# EAGLE design Pressure_Module_v2.1_jan2024 (EAGLE 9.6.2)

## Sheet 1 of 2: Connectors
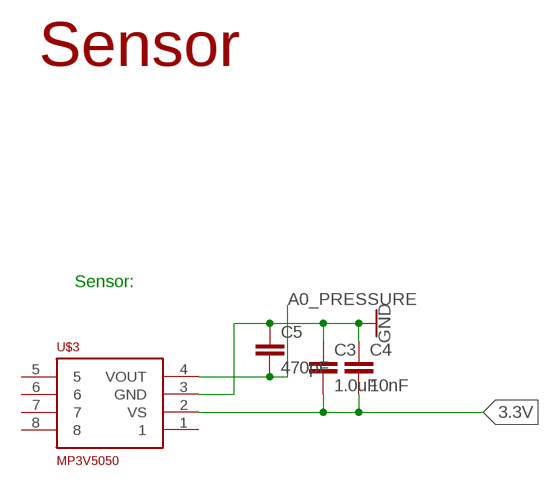
[diagram p0: schematic, sheet 1]

### Parts
C3  1.0uF  1.0UF-0603-16V-10%  [0603]
C4  10nF  10NF-0603-50V-10%  [0603]
C5  470pF  470PF-0603-50V-5%  [0603]
U$3  MP3V5050  [PRESSURE_SENSOR]

### Nets
3.3V: C3.2 C4.2 U$3.2(VS) ; also sheet 2
A0_PRESSURE: C5.2 U$3.4(VOUT) ; also sheet 2
GND: C3.1 C4.1 C5.1 U$3.3(GND) ; also sheet 2
Unconnected: U$3.1 U$3.5 U$3.6 U$3.7 U$3.8

### Notes on the sheet
- Sensor
- Sensor:

## Sheet 2 of 2: Microcontroller
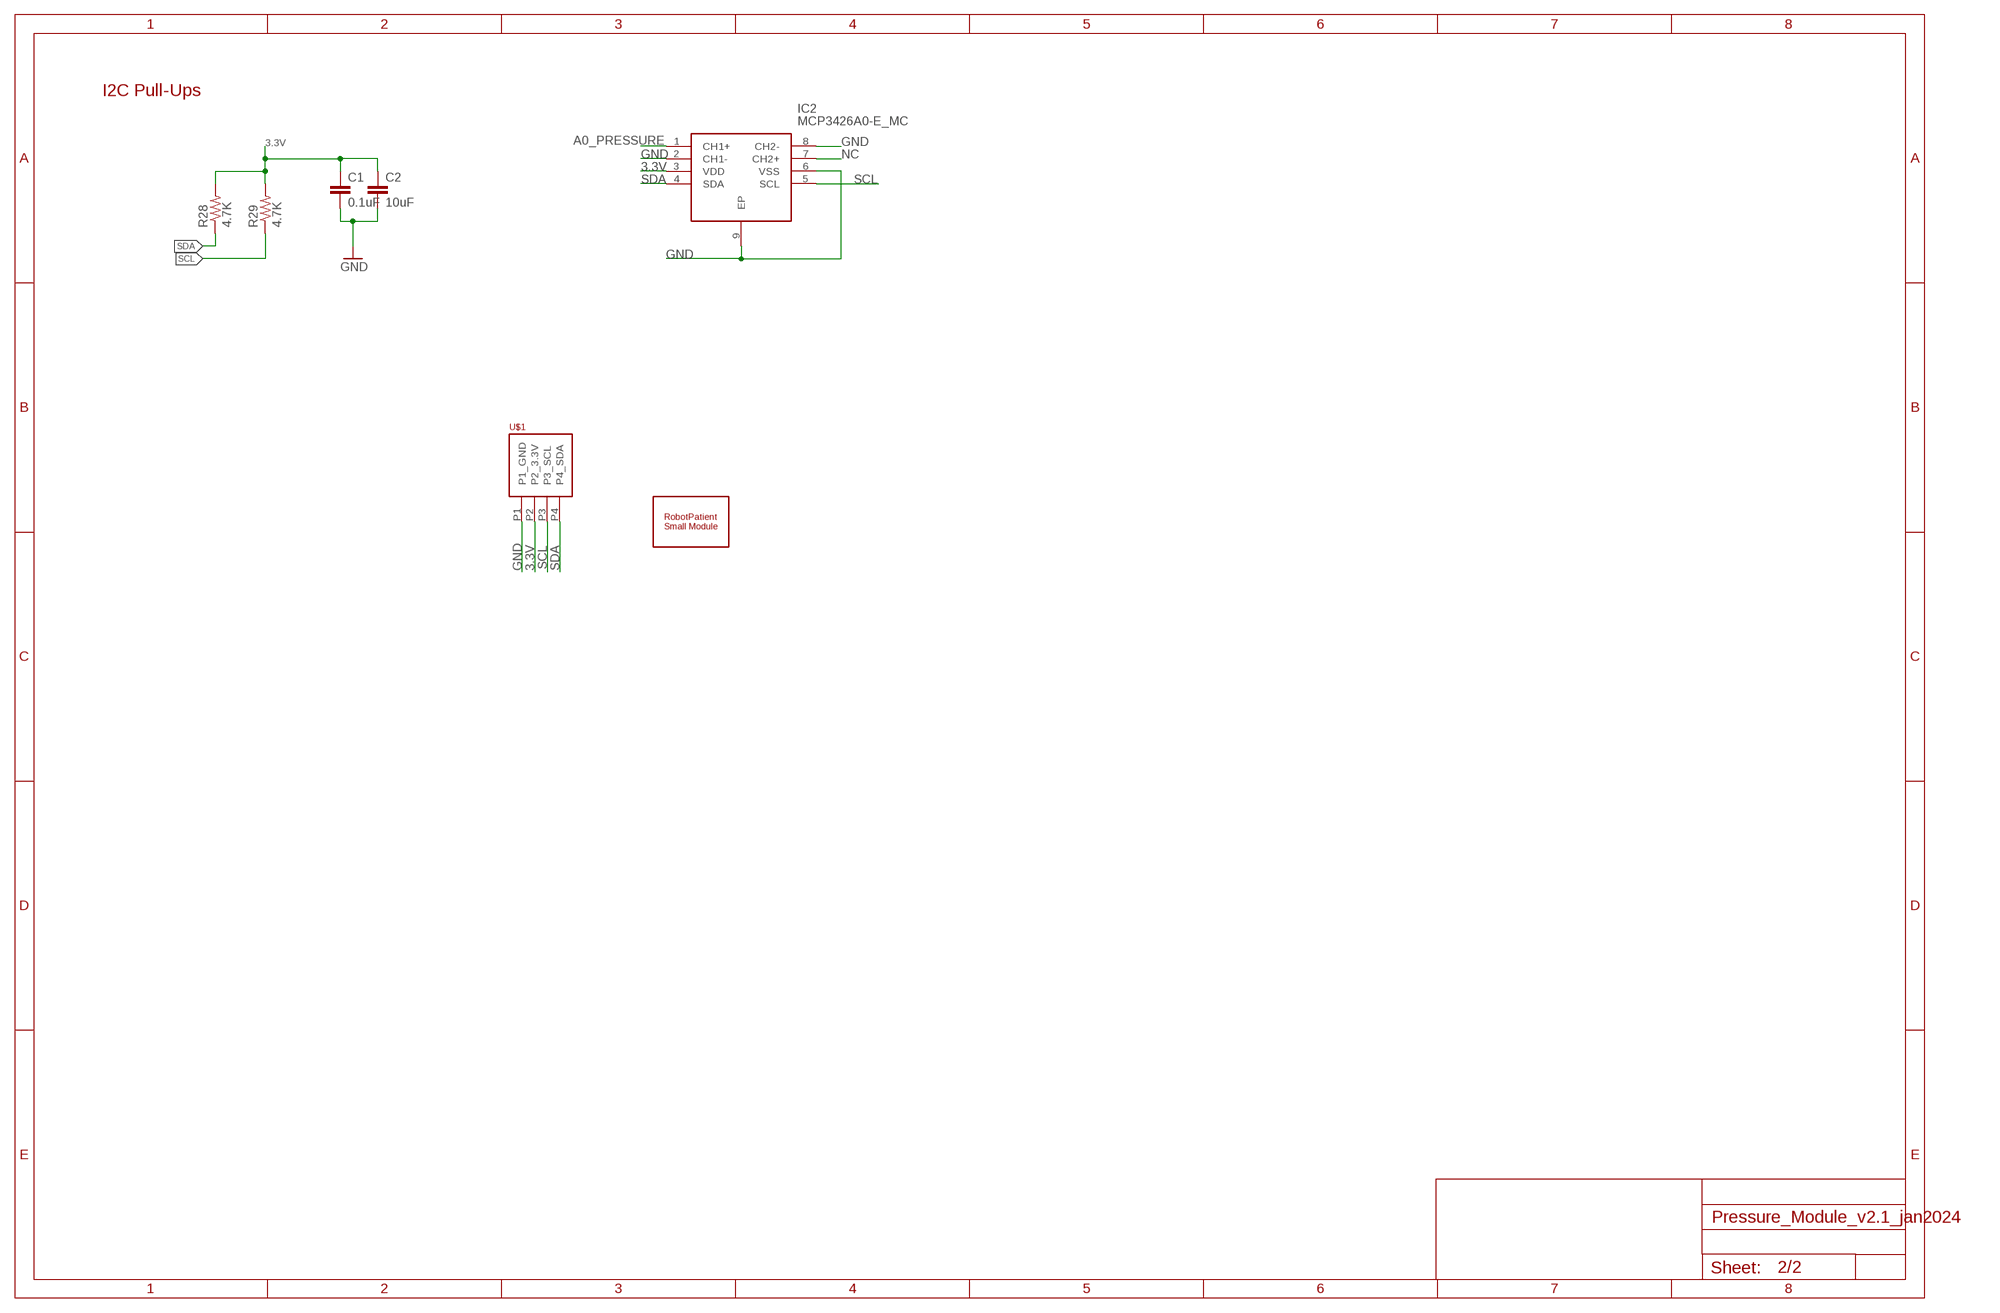
[diagram p1: schematic, sheet 2]

### Parts
C1  0.1uF  0.1UF-0603-25V-(+80/-20%)  [0603]
C2  10uF  10UF-0603-6.3V-20%  [0603]
IC2  MCP3426A0-E_MC  [SON50P300X200X100-9N]
R28  4.7K  4.7KOHM-1/10W-1%(0603)  [0603-RES]
R29  4.7K  4.7KOHM-1/10W-1%(0603)  [0603-RES]
U$1  PHOENIX_PTSM_M4_THANGLE  [PTSM_M4_TH]
U$2  ROBOTPATIENT_SMALL_MODULEBOARD  [RP_SMALL_SENSOR_OUTLINE]

### Nets
3.3V: C1.1 C2.1 IC2.3(VDD) R28.2 R29.2 U$1.P2(P2_3.3V) ; also sheet 1
A0_PRESSURE: IC2.1(CH1+) ; also sheet 1
GND: C1.2 C2.2 IC2.2(CH1-) IC2.6(VSS) IC2.8(CH2-) IC2.9(EP) U$1.P1(P1_GND) ; also sheet 1
NC: IC2.7(CH2+)
SCL: IC2.5(SCL) R29.1 U$1.P3(P3_SCL)
SDA: IC2.4(SDA) R28.1 U$1.P4(P4_SDA)

### Notes on the sheet
- I2C Pull-Ups

## Library data of the parts
C1 = SparkFun-Capacitors:0.1UF: 0.1µF ceramic capacitors A capacitor is a passive two-terminal electrical component used to store electrical energy temporarily in an electric field.; PROD_ID: CAP-00810
C2 = SparkFun-Capacitors:10UF: 10.0µF ceramic capacitors A capacitor is a passive two-terminal electrical component used to store electrical energy temporarily in an electric field.; PROD_ID: CAP-11015
C3 = SparkFun-Capacitors:1.0UF: 1µF ceramic capacitors A capacitor is a passive two-terminal electrical component used to store electrical energy temporarily in an electric field.; PROD_ID: CAP-00868
C4 = SparkFun-Capacitors:10NF: 0.01uF/10nF/10,000pF ceramic capacitors A capacitor is a passive two-terminal electrical component used to store electrical energy temporarily in an electric field. CAP-09321; PROD_ID: CAP-00867
C5 = SparkFun-Capacitors:470PF: 470pF ceramic capacitors A capacitor is a passive two-terminal electrical component used to store electrical energy temporarily in an electric field.; PROD_ID: CAP-07884
IC2 = MCP3426A0-E_MC:MCP3426A0-E_MC: MICROCHIP - MCP3426A0-E/MC - Analogue to Digital Converter, 16 bit, 15 SPS, Differential, Single Ended, I2C, Single, 2.7 V Source: Datasheet <http://www.microchip.com/mymicrochip/filehandler.aspx?ddocname=en546216>; DESCRIPTION: MICROCHIP - MCP3426A0-E/MC - Analogue to Digital Converter, 16 bit, 15 SPS, Differential, Single Ended, I2C, Single, 2.7 V; HEIGHT: 1mm; MANUFACTURER_NAME: Microchip; MANUFACTURER_PART_NUMBER: MCP3426A0-E/MC; MOUSER_PART_NUMBER: 579-MCP3426A0E/MC; MOUSER_PRICE-STOCK: https://www.mouser.co.uk/ProductDetail/Microchip-Technology/MCP3426A0-E-MC?qs=icxrp76fIjCY1JH54pALjQ%3D%3D
R28 R29 = SparkFun-Resistors:4.7KOHM-1/10W-1%(0603): RES-07857; PROD_ID: RES-07857
U$1 = jk_customs:PHOENIX_PTSM_M4_TH
U$2 = jk_customs:ROBOTPATIENT_SMALL_MODULE
U$3 = jk_customs:MP3V5050: MP3V5050 Datasheet <https://nl.mouser.com/datasheet/2/302/MP3V5050-1127012.pdf>

## Board
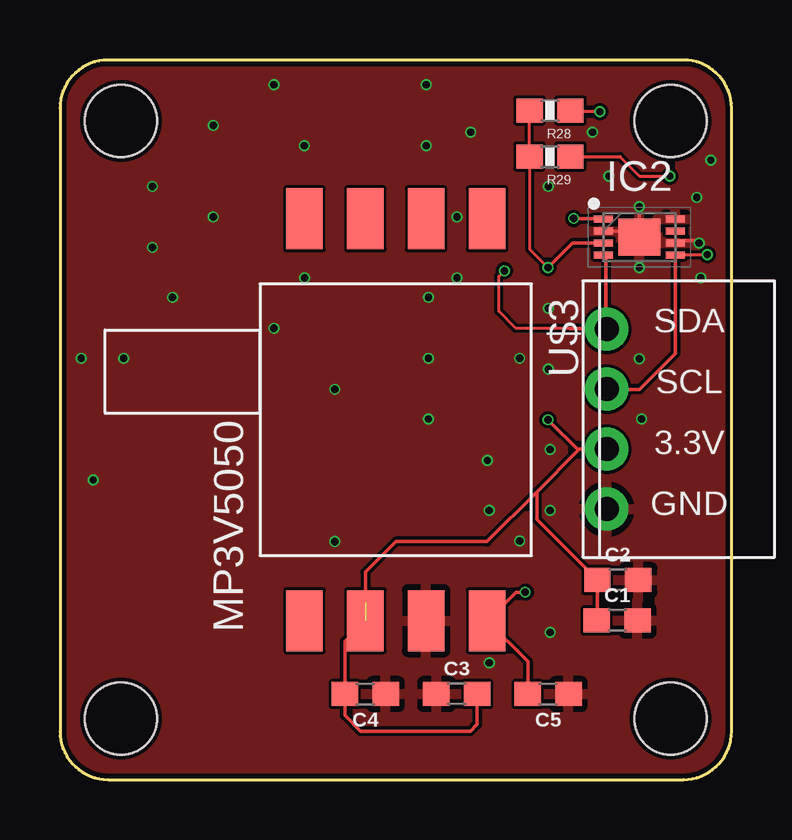
[diagram p2: board, top side]
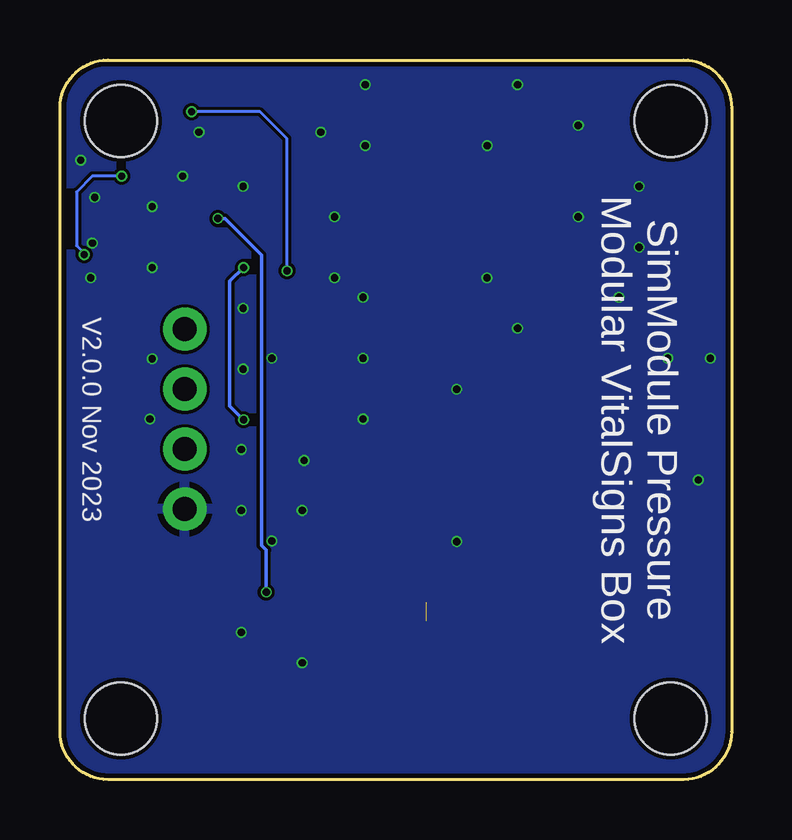
[diagram p3: board, bottom side, seen from below]

Size 28 x 30 mm. Coordinates in mm from the lower left corner, seen from the top.
Copper layers (1*16): Top 0.035mm / dielectric 1.6mm / Bottom 0.035mm
Design rules "jlcpcb-2layers_2023": minimum track width 5mil, minimum drill 0.3mm, track to track 5mil, track to pad 5mil, pad to pad 5mil, via to via 5mil, smd to smd 5mil, copper to edge 0.2mm, drill to drill 6mil, minimum pad ring 10mil, minimum via ring 3mil, stop-mask expansion 4mil, vias tented up to drill 20mil, thermal gap 10mil

### Footprints (pad centres in the part's own frame; a part is rotated, then mirrored left to right if it is on the bottom)
0603 = smd 1.1 x 1: 1 -0.85,0; 2 0.85,0
SON50P300X200X100-9N = smd 0.8 x 0.3: 1 -1.5,0.75; 2 -1.5,0.25; 3 -1.5,-0.25; 4 -1.5,-0.75; 5 1.5,-0.75; 6 1.5,-0.25; 7 1.5,0.25; 8 1.5,0.75 | smd 1.75 x 1.55: 9 0,0
0603-RES = smd 1.1 x 1: 1 -0.85,0; 2 0.85,0
PTSM_M4_TH = drill 1: P1 3.75,1; P2 1.25,1; P3 -1.25,1; P4 -3.75,1
RP_SMALL_SENSOR_OUTLINE = hole 3: -11.455,12.455; 11.455,12.455; 11.455,-12.455; -11.455,-12.455
PRESSURE_SENSOR = smd 2.54 x 1.52: 1 8.38,-3.81; 2 8.38,-1.27; 3 8.38,1.27; 4 8.38,3.81; 5 -8.38,3.81; 6 -8.38,1.27; 7 -8.38,-1.27; 8 -8.38,-3.81

### Placement (x,y rotation side)
C1  23.23,6.63 0 top
C2  23.26,8.32 0 top
C3  16.54,3.57 0 top
C4  12.73,3.57 180 top
C5  20.35,3.57 180 top
IC2  24.16,22.62 0 top
R28  20.43,27.89 180 top
R29  20.43,25.97 180 top
U$1  21.79,15.03 270 top
U$2  14,15 0 top
U$3  14,15 270 top

### Tracks (layer width: path | path; a pad name or v marks a point on that pad's centre or on a via)
3.3V  (via drill 0.3)  (1 unrouted)
  Top 0.127: R28.2 R29.2 19.58,22.12 v20.35,21.35
  Top 0.152: U$1.P2 21.66,13.78 21.62,13.73 | C1.1 22.41,6.66 C2.1 19.88,10.85 19.88,11.99 | IC2.3 21.37,22.37 v20.35,21.35 | v20.35,15 21.62,13.73 | 12.73,7.38 12.73,8.65 14,9.92 17.81,9.92 19.88,11.99 | 21.62,13.73 19.88,11.99 | U$3.2 11.88,5.77 C4.2 11.88,2.67 12.53,2.02 17.11,2.02 17.39,2.3 C3.2
  Bottom 0.152: v20.35,21.35 20.92,20.78 20.92,15.57 v20.35,15
A0_PRESSURE  (via drill 0.3)
  Top 0.152: C5.2 19.5,4.93 U$3.4 19,7.81 v19.4,7.81 | v21.42,23.39 22.63,23.39 IC2.1
  Bottom 0.152: v19.4,7.81 19.4,9.57 19.6,9.77 19.6,21.39 19.6,21.87 21.12,23.39 v21.42,23.39
GND  (via drill 0.3)
  Top 0.152: IC2.6 25.76,22.47 26.65,22.47 v26.65,22.37 | IC2.2 23.86,22.87 24.16,23.17 v24.16,23.89
  other vias: 8.92,18.81 10.19,26.43 15.27,26.43 15.27,28.97 8.92,28.97 22.89,25.16 24.16,21.35 24.16,17.54 11.46,16.27 11.46,9.92 15.36,17.57 15.36,20.11 15.36,15.03 19.17,9.95 17.9,11.22 20.44,6.14 17.9,4.87 1.39,12.49 2.66,17.57 0.88,17.57 4.69,20.11 3.85,22.19 3.85,24.73 6.39,27.27 6.39,23.46 10.2,20.92 16.55,23.46 16.55,20.92 20.36,24.73 19.17,17.57 24.25,15.03 20.44,13.76 20.44,11.22 20.36,19.65 20.36,17.11 17.82,13.3 26.71,20.92 27.13,25.82 26.55,24.27 22.2,26.99 17.12,26.99
  pour Top: -2.32,34.58 -2.32,-4.09 33.24,-4.09 33.24,36.55
  pour Bottom: -4.86,39.66 -4.86,-7.9 34.51,-7.9 34.51,41.84
SCL  (via drill 0.3)
  Top 0.127: R29.1 23.35,25.97 24.16,25.16 v25.43,25.16 | v26.99,21.89 26.97,21.87 IC2.5
  Top 0.152: IC2.5 25.66,17.77 24.16,16.27 U$1.P3
  Bottom 0.127: v25.43,25.16 26.65,25.16 27.31,24.5 27.31,22.25 26.97,21.91 v26.99,21.89
SDA  (via drill 0.3)
  Top 0.127: 21.62,18.81 19,18.81 18.29,19.52 18.29,20.97 v18.53,21.21 | v22.51,27.84 21.33,27.84 R28.1
  Top 0.152: 21.28,18.81 21.62,18.81 22.76,18.81 | 22.76,18.81 U$1.P4 | IC2.4 22.76,21.77 22.76,18.81
  Bottom 0.127: v18.53,21.21 18.53,26.72 19.65,27.84 v22.51,27.84

### Text on the board
_bsilk: SimModule Pressure / Modular VitalSigns Box